# Altium schematic sheet Power_Supply.SchDoc
size A4
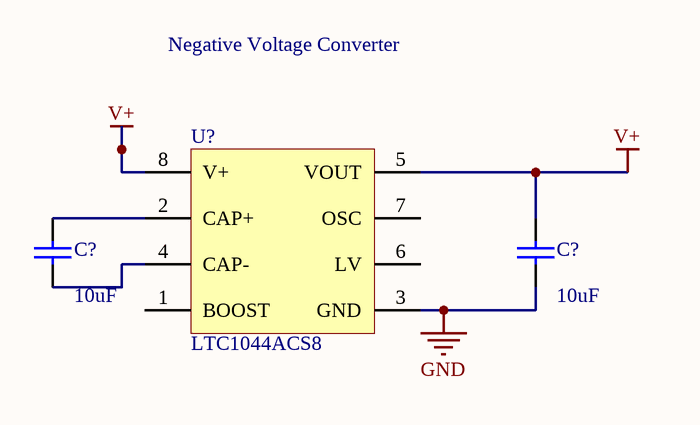
[diagram p0: Power_Supply.SchDoc]

## Parts
(Parts that share a designator on the sheet are numbered #1, #2 ... from top to bottom, then left to right.)
C?#1  value 10uF  [1608[0603]]  (hidden comment: Cap Semi)
C?#2  value 10uF  [1608[0603]]  (hidden comment: Cap Semi)
U?  LTC1044ACS8  [LT-S8-8_M]

## Nets
GND: C?#2.1 U?.3(GND)
V+: C?#2.2 U?.5(VOUT) U?.8(V+)
NetC?#1_1: C?#1.1 U?.4(CAP-)
NetC?#1_2: C?#1.2 U?.2(CAP+)

Not connected (* = marked no-connect by the designer): U? 1(BOOST) 6(LV) 7(OSC)

## Notes on the sheet
- Negative Voltage Converter

## Library data of the parts
C?#1 C?#2 = Cap Semi: Capacitor (Semiconductor SIM Model); Published: 8-Jun-2000; LatestRevisionDate: 29-May-2009; LatestRevisionNote: IPC-7351 Footprint Added.; PackageReference: C1206; Publisher: Altium Limited; PackageDescription: Chip Capacitor
U? = CMP-0475-00491-1: 12 V CMOS Voltage Converter, 8-pin SOIC (S8-8), 0 to 70 degC; Manufacturer: Linear Technology; Isupply(mA): 0.2; Voutput: 2Vin, -Vin, 0.5Vin; Vin Max(V): 12; Frequency(kHz): 5; Max Iout(mA): 20; Vin Min(V): 1.5; ComponentLink1Description: Manufacturer URL; PartNumber: LTC1044ACS8; PackageVersion: Rev. G, 03/2012; ComponentLink2URL: http://cds.linear.com/docs/en/datasheet/lt1044a.pdf; PackageReference: S8-8; ComponentLink2Description: Datasheet; DatasheetVersion: Rev. 0; RoHS: FALSE; PackageDescription: 8-Pin Plastic Small Outline (Narrow .150 Inch), Body 4.9 x 3.9 mm, Pitch 1.27 mm; ComponentLink3Description: Package Specification; Mounting Technology: Surface Mount; ComponentLink3URL: http://cds.linear.com/docs/en/packaging/05081610_G_SO8.pdf; ComponentLink1URL: http://www.linear.com/